# EAGLE design Callisto_Teknic_MSO_PBx4_v1p2 (EAGLE 9.6.2)
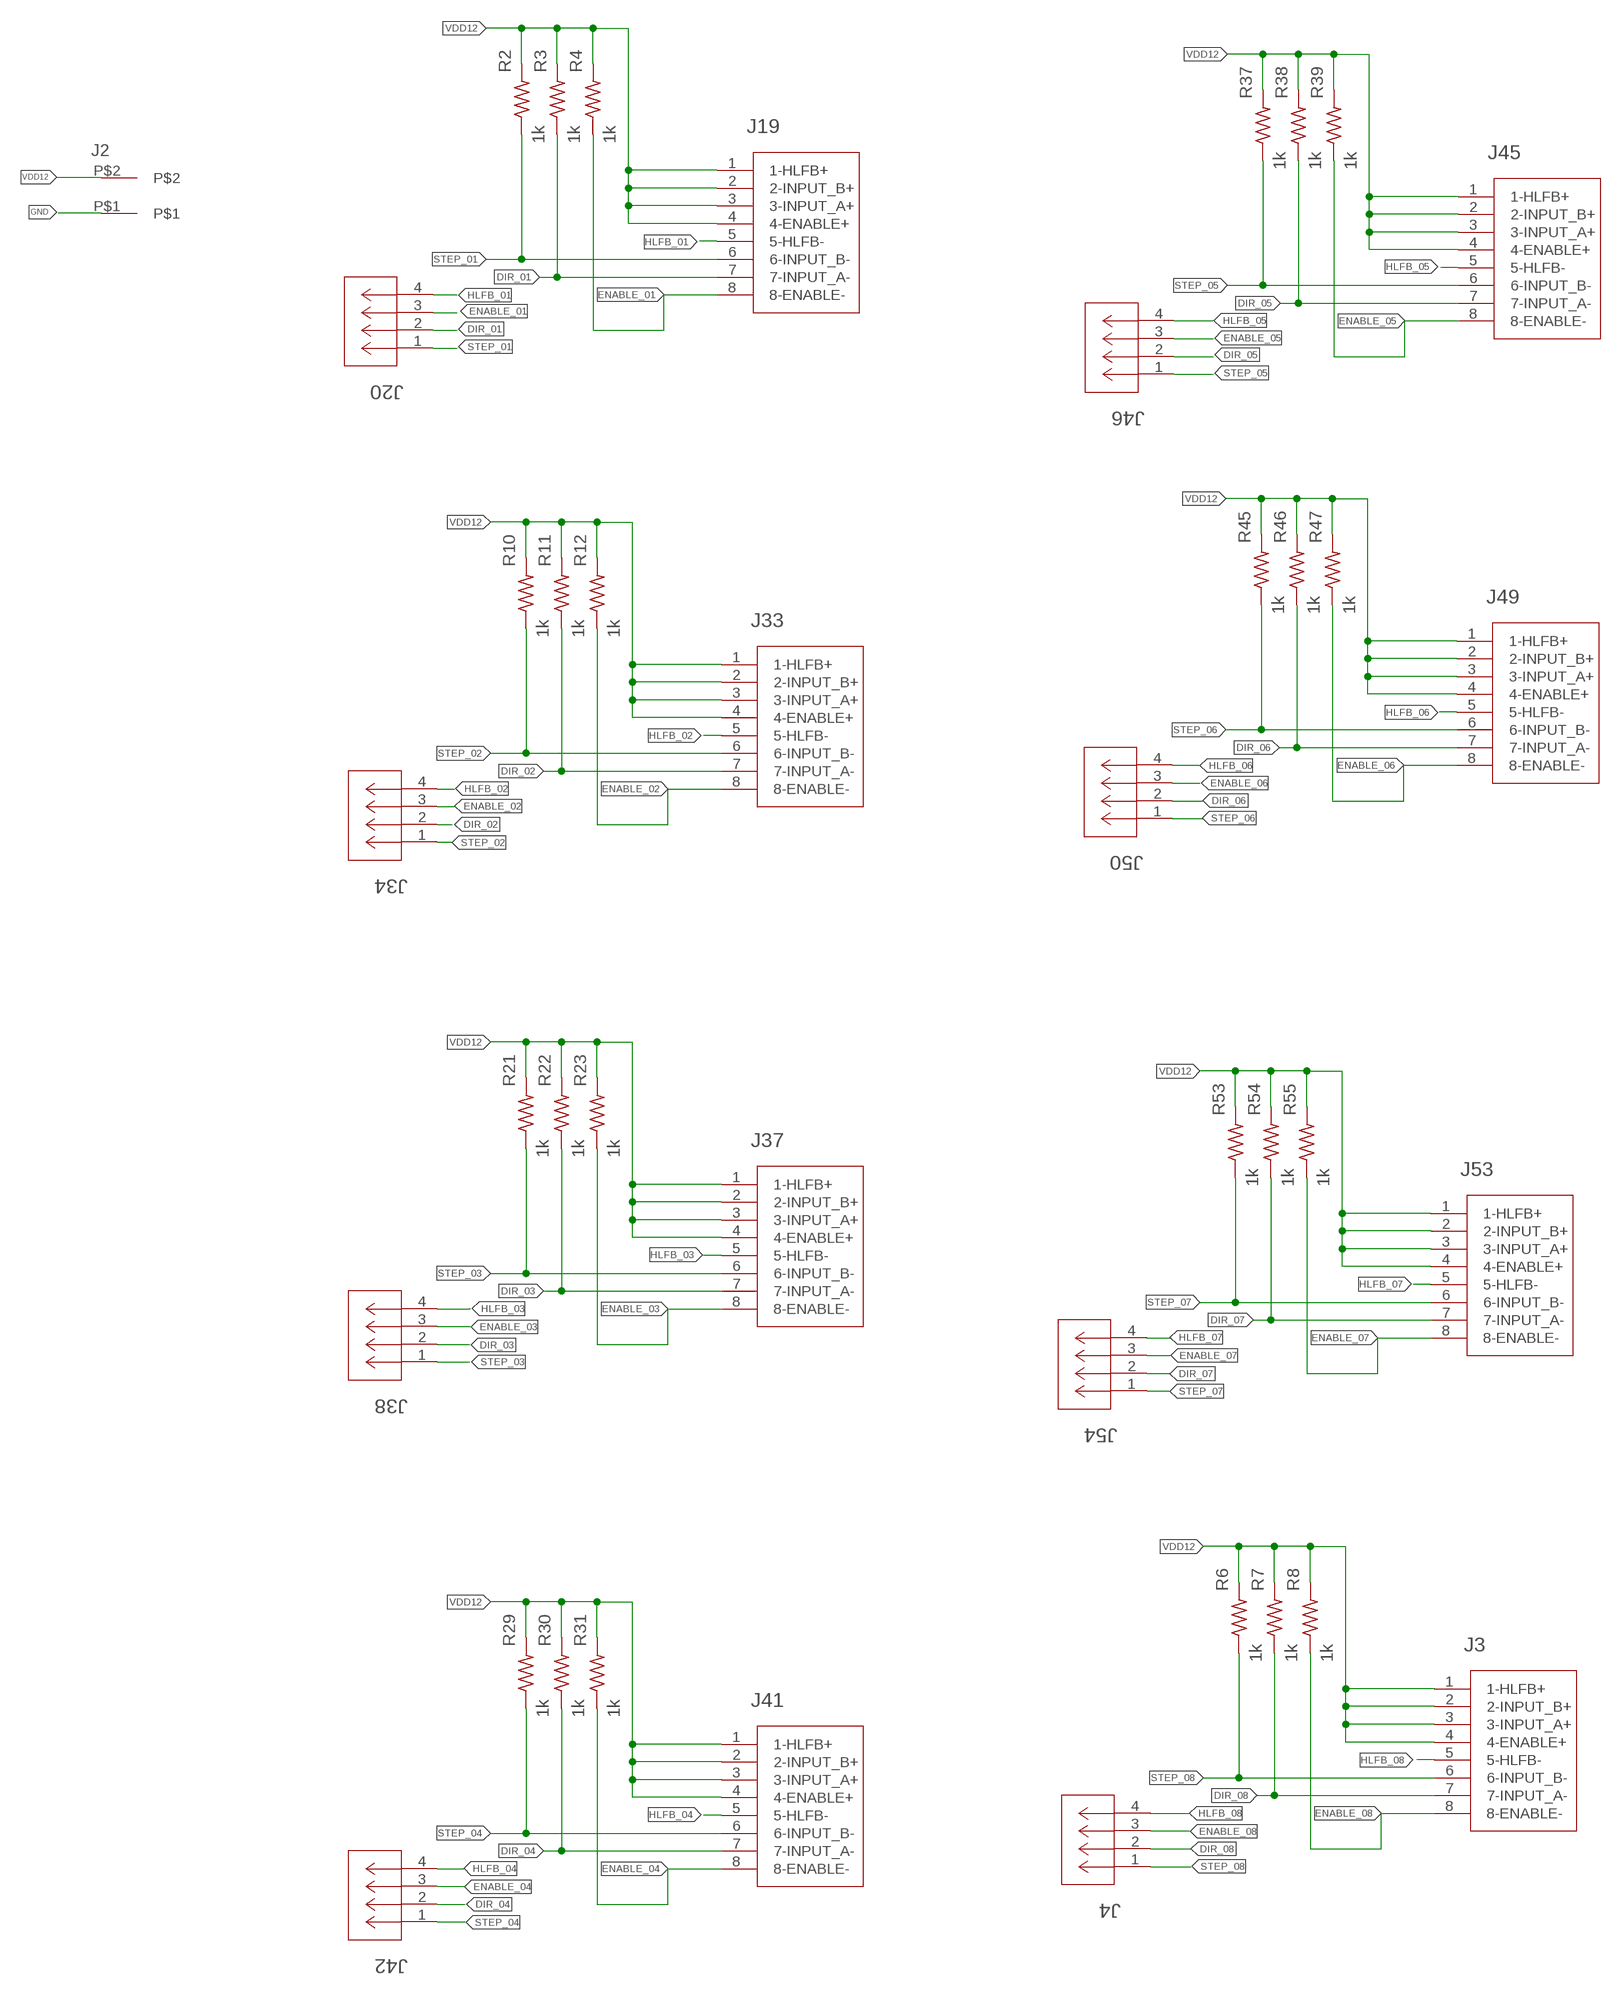
[diagram p0: schematic, sheet 1]

## Parts
J2  2-pos  3.81MM_1_X_2_RT_ANGLE_PLUG_HEADER  [2_3.81MM_PITCH]
J3  TEKNIC_8PIN_MOTOR  [CON_39281083]
J4  CONN_530470410_PICOBLADE_X_4  [CON_530470410_MOL]
J19  TEKNIC_8PIN_MOTOR  [CON_39281083]
J20  CONN_530470410_PICOBLADE_X_4  [CON_530470410_MOL]
J33  TEKNIC_8PIN_MOTOR  [CON_39281083]
J34  CONN_530470410_PICOBLADE_X_4  [CON_530470410_MOL]
J37  TEKNIC_8PIN_MOTOR  [CON_39281083]
J38  CONN_530470410_PICOBLADE_X_4  [CON_530470410_MOL]
J41  TEKNIC_8PIN_MOTOR  [CON_39281083]
J42  CONN_530470410_PICOBLADE_X_4  [CON_530470410_MOL]
J45  TEKNIC_8PIN_MOTOR  [CON_39281083]
J46  CONN_530470410_PICOBLADE_X_4  [CON_530470410_MOL]
J49  TEKNIC_8PIN_MOTOR  [CON_39281083]
J50  CONN_530470410_PICOBLADE_X_4  [CON_530470410_MOL]
J53  TEKNIC_8PIN_MOTOR  [CON_39281083]
J54  CONN_530470410_PICOBLADE_X_4  [CON_530470410_MOL]
R2  1k  R_0805  [0805]
R3  1k  R_0805  [0805]
R4  1k  R_0805  [0805]
R6  1k  R_0805  [0805]
R7  1k  R_0805  [0805]
R8  1k  R_0805  [0805]
R10  1k  R_0805  [0805]
R11  1k  R_0805  [0805]
R12  1k  R_0805  [0805]
R21  1k  R_0805  [0805]
R22  1k  R_0805  [0805]
R23  1k  R_0805  [0805]
R29  1k  R_0805  [0805]
R30  1k  R_0805  [0805]
R31  1k  R_0805  [0805]
R37  1k  R_0805  [0805]
R38  1k  R_0805  [0805]
R39  1k  R_0805  [0805]
R45  1k  R_0805  [0805]
R46  1k  R_0805  [0805]
R47  1k  R_0805  [0805]
R53  1k  R_0805  [0805]
R54  1k  R_0805  [0805]
R55  1k  R_0805  [0805]

## Nets
DIR_01: J19.7(7-INPUT_A-) J20.2 R3.1
DIR_02: J33.7(7-INPUT_A-) J34.2 R11.1
DIR_03: J37.7(7-INPUT_A-) J38.2 R22.1
DIR_04: J41.7(7-INPUT_A-) J42.2 R30.1
DIR_05: J45.7(7-INPUT_A-) J46.2 R38.1
DIR_06: J49.7(7-INPUT_A-) J50.2 R46.1
DIR_07: J53.7(7-INPUT_A-) J54.2 R54.1
DIR_08: J3.7(7-INPUT_A-) J4.2 R7.1
ENABLE_01: J19.8(8-ENABLE-) J20.3 R4.1
ENABLE_02: J33.8(8-ENABLE-) J34.3 R12.1
ENABLE_03: J37.8(8-ENABLE-) J38.3 R23.1
ENABLE_04: J41.8(8-ENABLE-) J42.3 R31.1
ENABLE_05: J45.8(8-ENABLE-) J46.3 R39.1
ENABLE_06: J49.8(8-ENABLE-) J50.3 R47.1
ENABLE_07: J53.8(8-ENABLE-) J54.3 R55.1
ENABLE_08: J3.8(8-ENABLE-) J4.3 R8.1
GND: J2.P$1
HLFB_01: J19.5(5-HLFB-) J20.4
HLFB_02: J33.5(5-HLFB-) J34.4
HLFB_03: J37.5(5-HLFB-) J38.4
HLFB_04: J41.5(5-HLFB-) J42.4
HLFB_05: J45.5(5-HLFB-) J46.4
HLFB_06: J49.5(5-HLFB-) J50.4
HLFB_07: J53.5(5-HLFB-) J54.4
HLFB_08: J3.5(5-HLFB-) J4.4
STEP_01: J19.6(6-INPUT_B-) J20.1 R2.1
STEP_02: J33.6(6-INPUT_B-) J34.1 R10.1
STEP_03: J37.6(6-INPUT_B-) J38.1 R21.1
STEP_04: J41.6(6-INPUT_B-) J42.1 R29.1
STEP_05: J45.6(6-INPUT_B-) J46.1 R37.1
STEP_06: J49.6(6-INPUT_B-) J50.1 R45.1
STEP_07: J53.6(6-INPUT_B-) J54.1 R53.1
STEP_08: J3.6(6-INPUT_B-) J4.1 R6.1
VDD12: J2.P$2 J3.1(1-HLFB+) J3.2(2-INPUT_B+) J3.3(3-INPUT_A+) J3.4(4-ENABLE+) J19.1(1-HLFB+) J19.2(2-INPUT_B+) J19.3(3-INPUT_A+) J19.4(4-ENABLE+) J33.1(1-HLFB+) J33.2(2-INPUT_B+) J33.3(3-INPUT_A+) J33.4(4-ENABLE+) J37.1(1-HLFB+) J37.2(2-INPUT_B+) J37.3(3-INPUT_A+) J37.4(4-ENABLE+) J41.1(1-HLFB+) J41.2(2-INPUT_B+) J41.3(3-INPUT_A+) J41.4(4-ENABLE+) J45.1(1-HLFB+) J45.2(2-INPUT_B+) J45.3(3-INPUT_A+) J45.4(4-ENABLE+) J49.1(1-HLFB+) J49.2(2-INPUT_B+) J49.3(3-INPUT_A+) J49.4(4-ENABLE+) J53.1(1-HLFB+) J53.2(2-INPUT_B+) J53.3(3-INPUT_A+) J53.4(4-ENABLE+) R2.2 R3.2 R4.2 R6.2 R7.2 R8.2 R10.2 R11.2 R12.2 R21.2 R22.2 R23.2 R29.2 R30.2 R31.2 R37.2 R38.2 R39.2 R45.2 R46.2 R47.2 R53.2 R54.2 R55.2

## Library data of the parts
J2 = 3D_MIG_Controller:3.81MM_1_X_2_RT_ANGLE_PLUG_HEADER: TERM BLOCK HDR 2POS 90DEG 3.81MM; PARTNO: 691322310002
J3 J19 J33 J37 J41 J45 J49 J53 = 3D_MIG_Controller:TEKNIC_8PIN_MOTOR; COPYRIGHT: Copyright (C) 2022 Ultra Librarian. All rights reserved.; MANUFACTURER_PART_NUMBER: 39281083; MFR_NAME: Molex Connector Corporation
J4 J20 J34 J38 J42 J46 J50 J54 = 3D_MIG_Controller:CONN_530470410_PICOBLADE_X_4; COPYRIGHT: Copyright (C) 2022 Ultra Librarian. All rights reserved.; MANUFACTURER_PART_NUMBER: 530470410; MFR_NAME: Molex Connector Corporation
R2-R4 R6-R8 R10-R12 R21-R23 R29-R31 R37-R39 R45-R47 R53-R55 = 3D_MIG_Controller:R_0805

## Board
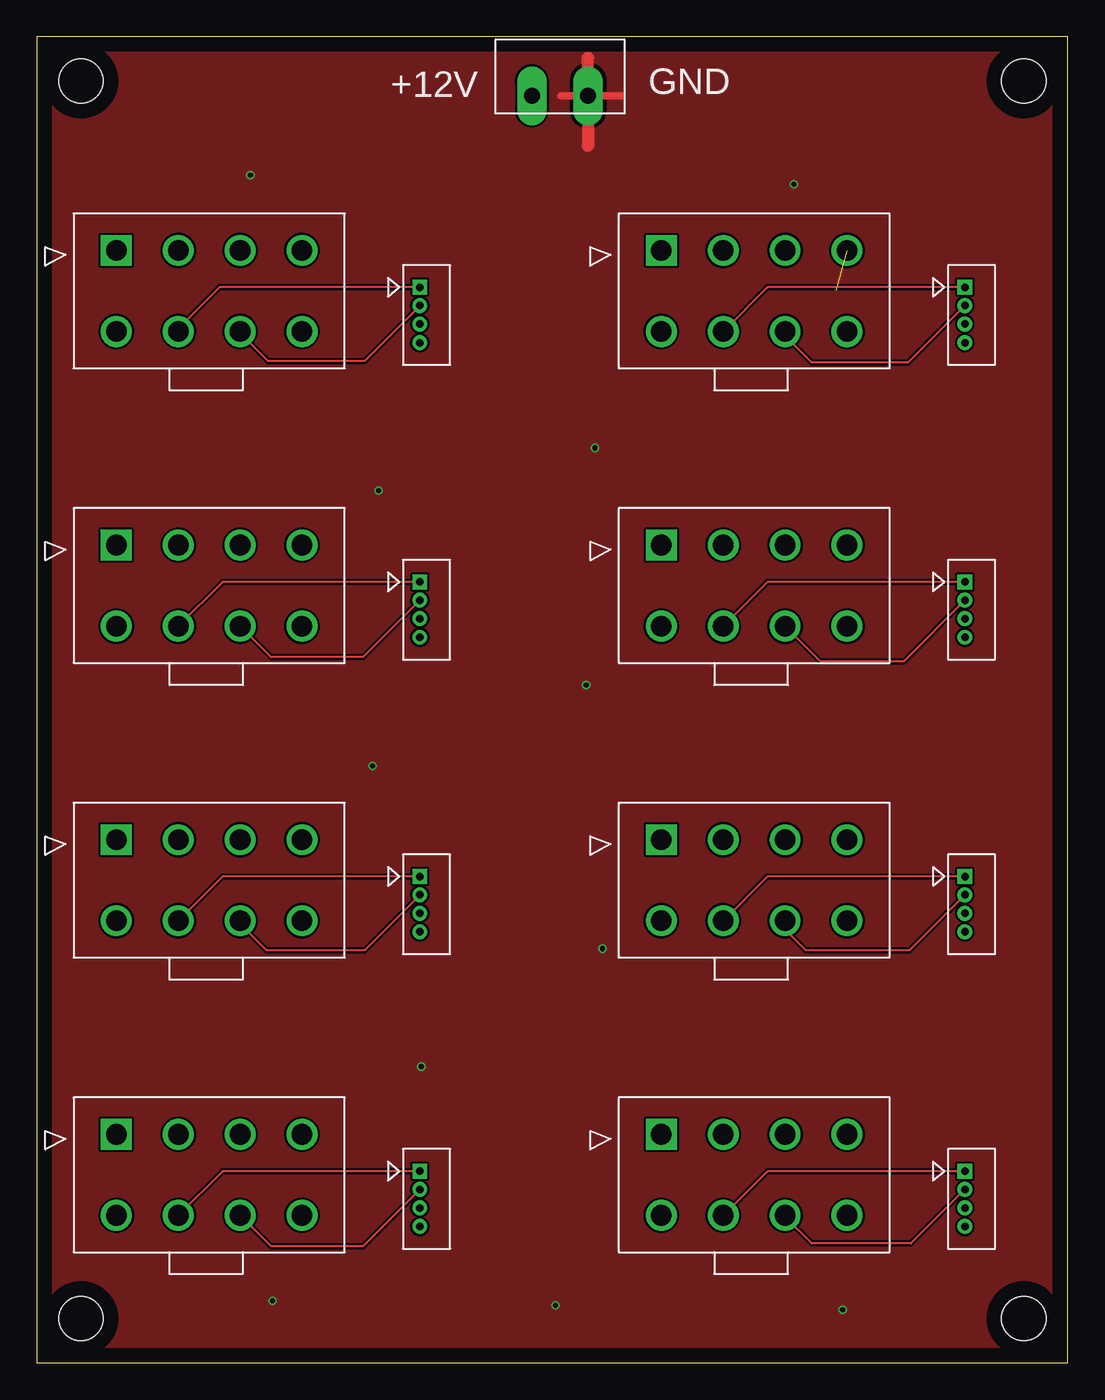
[diagram p1: board, top side]
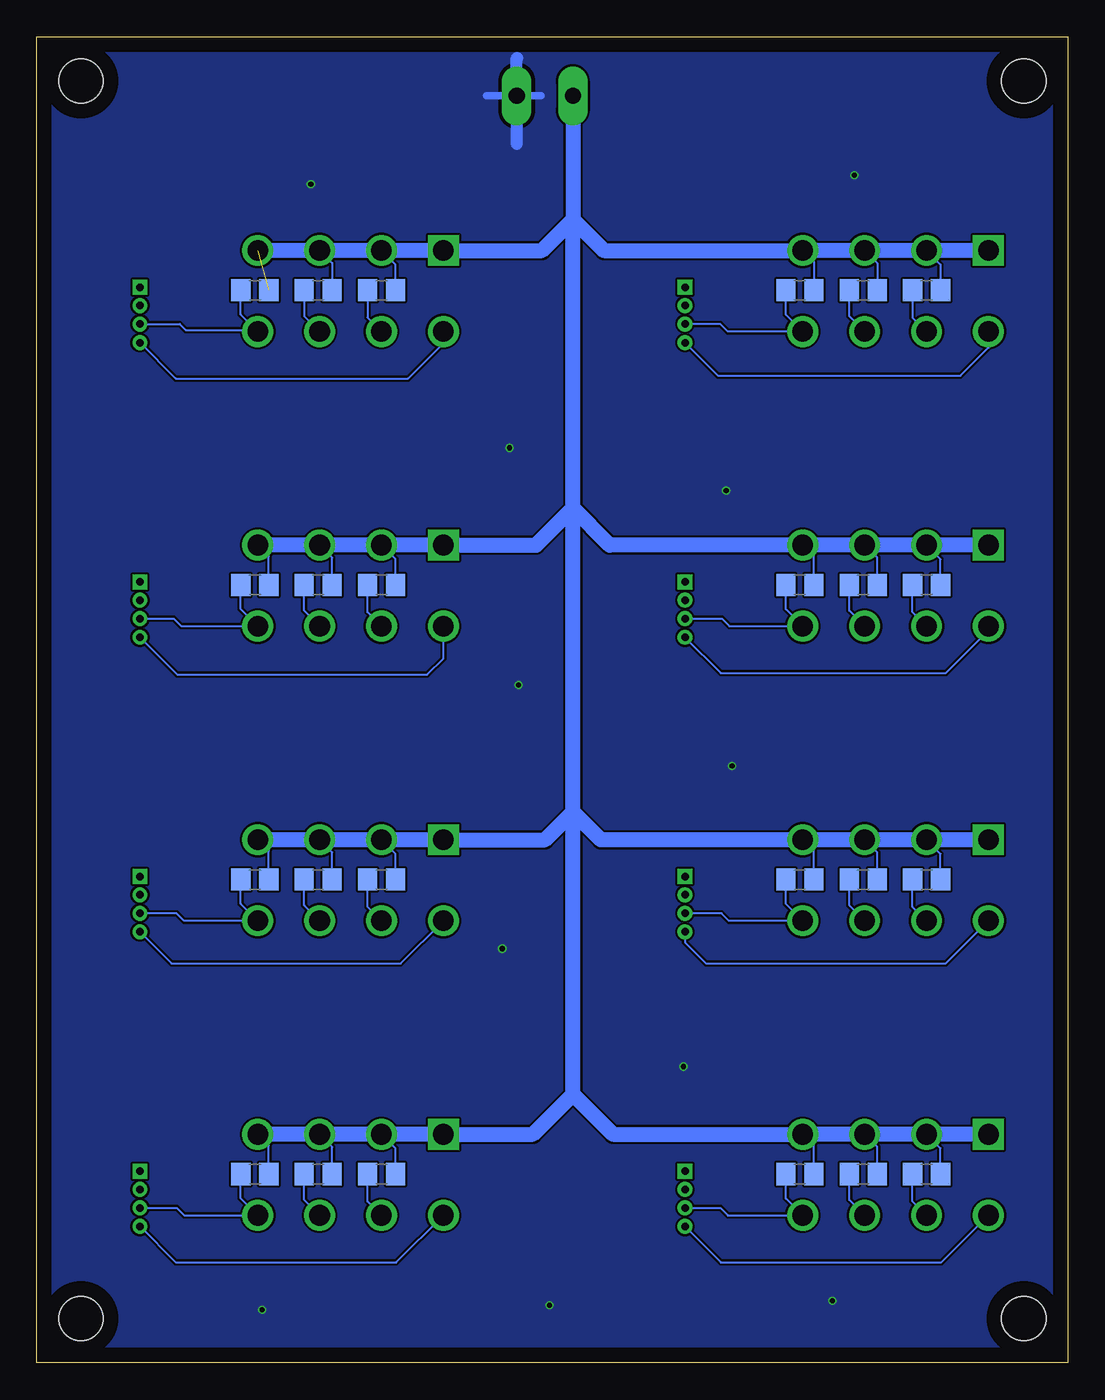
[diagram p2: board, bottom side, seen from below]

Size 70 x 90 mm. Coordinates in mm from the lower left corner, seen from the top.
Outline: 0,0 70,0 70,90 0,90 0,0
Copper layers (1*16): Top 0.035mm / dielectric 1.5mm / Bottom 0.035mm
Design rules "default": minimum track width 6mil, minimum drill 0.2mm, track to track 6mil, track to pad 6mil, pad to pad 6mil, via to via 6mil, smd to smd 6mil, copper to edge 40mil, drill to drill 6mil, minimum pad ring 10mil, minimum via ring 4mil, stop-mask expansion 4mil, vias tented up to drill 0mil, thermal gap 10mil
Holes 3 mm at 3,3 67,3 67,87 3,87

### Footprints (pad centres in the part's own frame; a part is rotated, then mirrored left to right if it is on the bottom)
2_3.81MM_PITCH = drill 1.1 pad 2 long: P$1 0,0; P$2 3.81,0
CON_39281083 = drill 1.397 pad 1.905 square: 1 12.6,-5.5 | drill 1.397 pad 1.905: 2 8.4,-5.5; 3 4.2,-5.5; 4 0,-5.5; 5 12.6,0; 6 8.4,0; 7 4.2,0; 8 0,0
CON_530470410_MOL = drill 0.508 pad 0.838 square: 1 0,0 | drill 0.508 pad 0.838: 2 -1.245,0; 3 -2.489,0; 4 -3.759,0
0805 = smd 1.3 x 1.5: 1 -0.95,0; 2 0.95,0

### Placement (x,y rotation side)
J2  37.42,86 180 top
J3  55,70 180 top
J4  63,73 90 top
J19  18,10 180 top
J20  26,13 90 top
J33  18,30 180 top
J34  26,33 90 top
J37  18,50 180 top
J38  26,53 90 top
J41  18,70 180 top
J42  26,73 90 top
J45  55,10 180 top
J46  63,13 90 top
J49  55,30 180 top
J50  63,33 90 top
J53  55,50 180 top
J54  63,53 90 top
R2  9.6,12.8 0 bottom
R3  13.9,12.8 0 bottom
R4  18.2,12.8 0 bottom
R6  46.6,72.8 0 bottom
R7  50.9,72.8 0 bottom
R8  55.2,72.8 0 bottom
R10  9.6,32.8 0 bottom
R11  13.9,32.8 0 bottom
R12  18.2,32.8 0 bottom
R21  9.6,52.8 0 bottom
R22  13.9,52.8 0 bottom
R23  18.2,52.8 0 bottom
R29  9.6,72.8 0 bottom
R30  13.9,72.8 0 bottom
R31  18.2,72.8 0 bottom
R37  46.6,12.8 0 bottom
R38  50.9,12.8 0 bottom
R39  55.2,12.8 0 bottom
R45  46.6,32.8 0 bottom
R46  50.9,32.8 0 bottom
R47  55.2,32.8 0 bottom
R53  46.6,52.8 0 bottom
R54  50.9,52.8 0 bottom
R55  55.2,52.8 0 bottom

### Tracks (layer width: path | path; a pad name or v marks a point on that pad's centre or on a via)
DIR_01
  Top 0.152: J20.2 22.14,7.9 15.9,7.9 J19.7
  Bottom 0.152: J19.7 14.85,11.05 R3.1
DIR_02
  Top 0.152: J34.2 22.25,28 15.6,28 13.8,29.8 J33.7
  Bottom 0.152: J33.7 14.85,31.05 R11.1
DIR_03
  Top 0.152: J38.2 22.14,47.9 15.9,47.9 J37.7
  Bottom 0.152: J37.7 14.85,51.05 R22.1
DIR_04
  Top 0.152: J42.2 22.25,68 15.7,68 13.8,69.9 J41.7
  Bottom 0.152: J41.7 14.85,71.05 R30.1
DIR_05
  Top 0.152: J46.2 59.34,8.1 52.6,8.1 50.8,9.9 J45.7
  Bottom 0.152: J45.7 51.85,11.05 R38.1
DIR_06
  Top 0.152: J50.2 59.24,28 52.2,28 50.8,29.4 J49.7
  Bottom 0.152: J49.7 51.85,31.05 R46.1
DIR_07
  Top 0.152: J54.2 58.84,47.6 53.2,47.6 J53.7
  Bottom 0.152: J53.7 51.85,51.05 R54.1
DIR_08
  Top 0.152: J4.2 59.15,67.9 52.6,67.9 50.8,69.7 J3.7
  Bottom 0.152: R7.1 51.85,71.05 J3.7
ENABLE_01
  Bottom 0.152: R4.1 19.15,11.15 J19.8 23.09,10 23.6,10.51 J20.3
ENABLE_02
  Bottom 0.152: R12.1 19.15,31.15 J33.8 23,30 23.51,30.51 J34.3
ENABLE_03
  Bottom 0.152: R23.1 19.15,51.15 J37.8 22.99,50 23.5,50.51 J38.3
ENABLE_04
  Bottom 0.152: R31.1 19.15,71.15 J41.8 23.09,70 23.6,70.51 J42.3
ENABLE_05
  Bottom 0.152: R39.1 56.15,11.15 J45.8 59.99,10 60.5,10.51 J46.3
ENABLE_06
  Bottom 0.152: R47.1 56.15,31.15 J49.8 60,30 60.51,30.51 J50.3
ENABLE_07
  Bottom 0.152: R55.1 56.15,51.15 J53.8 60.19,50 60.7,50.51 J54.3
ENABLE_08
  Bottom 0.152: J3.8 55.1,70.1 | 55.1,70.1 56.15,71.15 R8.1 | J4.3 60.3,70.51 59.89,70.1 55.1,70.1
GND  (via drill 0.35)
  Top 0.508: 39.73,86 J2.P$1 35.57,86
  Top 0.813: 37.4,88.58 37.42,88.56 J2.P$1 37.42,82.62 37.4,82.6
  Bottom 0.508: 39.47,86 J2.P$1 35.77,86
  Bottom 0.813: 37.4,88.58 37.42,88.56 J2.P$1 37.42,82.72
  other vias: 16,4.2 35.2,3.9 54.7,3.6 26.1,20.1 38.4,28.1 22.8,40.5 37.3,46 23.2,59.2 37.9,62.1 14.5,80.6 51.4,80
  pour Bottom: 0,90 70,90 70,0 0,0
  pour Top: 0,90 70,90 70,0 0,0
HLFB_01
  Bottom 0.152: J20.4 23.56,6.8 8.6,6.8 J19.5
HLFB_02
  Bottom 0.152: J34.4 26,28.54 24.56,27.1 8.3,27.1 J33.5
HLFB_03
  Bottom 0.152: J38.4 23.56,46.8 8.3,46.8 5.4,49.7 J37.5
HLFB_04
  Bottom 0.152: J42.4 23.76,67 7.3,67 5.4,68.9 J41.5
HLFB_05
  Bottom 0.152: J46.4 60.56,6.8 45.6,6.8 J45.5
HLFB_06
  Bottom 0.152: J50.4 60.86,27.1 45.3,27.1 J49.5
HLFB_07
  Bottom 0.152: J54.4 60.46,46.7 43.5,46.7 42.4,47.8 J53.5
HLFB_08
  Bottom 0.152: J4.4 60.56,66.8 44.8,66.8 42.4,69.2 J3.5
STEP_01
  Top 0.152: J20.1 12.6,13 J19.6
  Bottom 0.152: J19.6 10.55,10.95 R2.1
STEP_02
  Top 0.152: J34.1 12.6,33 J33.6
  Bottom 0.152: J33.6 10.55,30.95 R10.1
STEP_03
  Top 0.152: J38.1 12.6,53 J37.6
  Bottom 0.152: J37.6 10.55,50.95 R21.1
STEP_04
  Top 0.152: J42.1 12.4,73 9.6,70.2 J41.6
  Bottom 0.152: R29.1 10.55,70.95 J41.6
STEP_05
  Top 0.152: J46.1 49.6,13 J45.6
  Bottom 0.152: J45.6 47.55,10.95 R37.1
STEP_06
  Top 0.152: J50.1 49.6,33 J49.6
  Bottom 0.152: J49.6 47.55,30.95 R45.1
STEP_07
  Top 0.152: J54.1 49.6,53 J53.6
  Bottom 0.152: J53.6 47.55,50.95 R53.1
STEP_08
  Top 0.152: J4.1 49.6,73 J3.6
  Bottom 0.152: R6.1 47.55,70.95 J3.6
VDD12  (1 unrouted)
  Bottom 0.152: J41.2 8.65,74.55 R29.2 | J41.4 17.25,74.75 R31.2 | J41.3 12.95,74.65 R30.2 | R6.2 45.65,74.55 J3.2 | J3.3 49.95,74.65 R7.2 | R21.2 8.65,54.55 J37.2 | R22.2 12.95,54.65 J37.3 | R23.2 17.25,54.75 J37.4 | R53.2 45.65,54.55 J53.2 | R54.2 49.95,54.65 J53.3 | R55.2 54.25,54.75 J53.4 | R10.2 8.65,34.55 J33.2 | R11.2 12.95,34.65 J33.3 | R12.2 17.25,34.75 J33.4 | R45.2 45.65,34.55 J49.2 | R46.2 49.95,34.65 J49.3 | R47.2 54.25,34.75 J49.4 | R2.2 8.65,14.55 J19.2 | R3.2 12.95,14.65 J19.3 | R4.2 17.25,14.75 J19.4 | R37.2 45.65,14.55 J45.2 | R38.2 49.95,14.65 J45.3 | R39.2 54.25,14.75 J45.4
  Bottom 0.305: 17.35,35.75 J33.4 | 17.35,55.05 J37.4 | 45.55,35.55 J49.2 | 49.75,35.55 J49.3 | 54.25,55.25 J53.4
  Bottom 1.016: J19.1 J19.2 J19.3 J19.4 30.9,15.5 33.61,18.21 | J33.1 J33.2 J33.3 J33.4 31.71,35.5 33.61,37.4 | J37.1 J37.2 J37.3 J37.4 31.11,55.5 33.61,58 | J41.1 J41.2 J41.3 J41.4 31.51,75.5 33.61,77.6 | J45.4 J45.3 J45.2 J45.1 36.32,15.5 33.61,18.21 | J49.4 J49.3 J49.2 J49.1 35.51,35.5 33.61,37.4 | J53.4 J53.3 J53.2 J53.1 36.11,55.5 33.61,58 | J2.P$2 33.61,77.6 | 33.61,18.21 33.61,37.4 | 33.61,37.4 33.61,58 | 33.61,58 33.61,77.6 | J3.4 J3.3 J3.2 J3.1 35.71,75.5 33.61,77.6

### Text on the board
tPlace: +12V | GND